# Altium schematic sheet drvoutput1.SchDoc
size A4
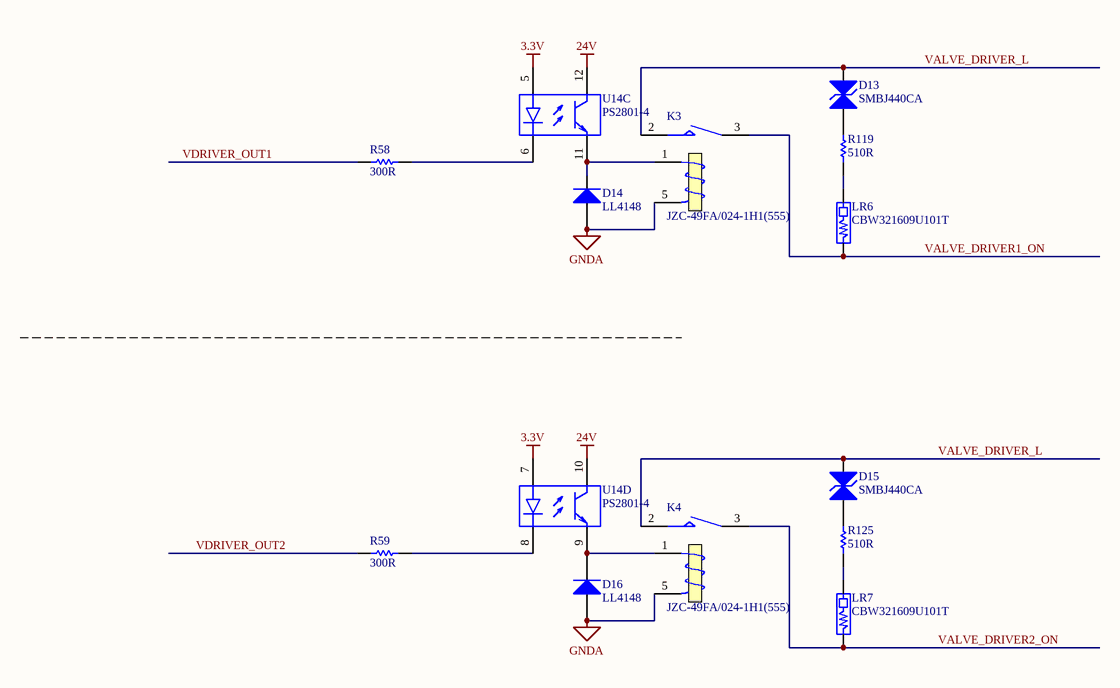
[diagram p0: drvoutput1.SchDoc]

## Parts
D13  SMBJ440CA  [SMB]
D14  LL4148  [CD2012-0805]
D15  SMBJ440CA  [SMB]
D16  LL4148  [CD2012-0805]
K3  JZC-49FA/024-1H1(555)  [JZC-49FA]
K4  JZC-49FA/024-1H1(555)  [JZC-49FA]
LR6  CBW321609U101T  [INDC3216M]
LR7  CBW321609U101T  [INDC3216M]
R58  300R  [RESC2012M]
R59  300R  [RESC2012M]
R119  510R  [RESC3216M]
R125  510R  [RESC3216M]
U14  PS2801-4  [SOIC16_N]  (parts C,D of 4)

## Nets
3.3V: U14.5(+) U14.7(+)
24V: U14.10(C) U14.12(C)
GNDA: D14.1(A) D16.1(A) K3.5(T2) K4.5(T2)
VALVE_DRIVER1_ON: K3.3(NO) LR6.1
VALVE_DRIVER2_ON: K4.3(NO) LR7.1
VALVE_DRIVER_L: D13.2(K) D15.2(K) K3.2(COM) K4.2(COM)
VDRIVER_OUT1: R58.1
VDRIVER_OUT2: R59.1
NetD13_1: D13.1(A) R119.2
NetD14_2: D14.2(K) K3.1 U14.11(E)
NetD15_1: D15.1(A) R125.2
NetD16_2: D16.2(K) K4.1 U14.9(E)
NetLR6_2: LR6.2 R119.1
NetLR7_2: LR7.2 R125.1
NetR58_2: R58.2 U14.6(-)
NetR59_2: R59.2 U14.8(-)

## Library data of the parts
D13 D15 = Bi-dir TVS Diode: Published: 8-Jun-2000; LatestRevisionDate: 17-Jul-2002; LatestRevisionNote: Re-released for DXP Platform.; PackageReference: DIODE-0.7; Publisher: Altium Limited
D14 D16 = Diode 1N4007: 1 Amp General Purpose Rectifier; Published: 8-Jun-2000; LatestRevisionDate: 17-Jul-2002; LatestRevisionNote: Re-released for DXP Platform.; DatasheetVersion: 1998; PackageVersion: Aug-1999; PackageReference: DO-41; Publisher: Altium Limited; Code_JEDEC: DO-204-AL; ComponentLink1Description: Manufacturer Link; ComponentLink1URL: http://www.fairchildsemi.com/; ComponentLink2Description: Datasheet; ComponentLink2URL: http://www.fairchildsemi.com/ds/1N%2F1N4001.pdf
K3 K4 = JZC-49FA: Intermediate  Power  Relay; Published: 8-Jun-2000; LatestRevisionDate: 17-Jul-2002; LatestRevisionNote: Re-released for DXP Platform.; PackageReference: MODULE5B; Publisher: Altium Limited
LR6 LR7 = BLM10/11/21/31/41: EMI FILTERS,DC Resistance max.0.05~1.5 ohms,10 ~ 1000 ohms at 100MHz  Frequency
R58 R59 = Res1: Resistor; Value: 10K; Published: 8-Jun-2000; LatestRevisionDate: 17-Jul-2002; LatestRevisionNote: Re-released for DXP Platform.; PackageReference: AXIAL-0.3; Publisher: Altium Limited
R119 R125 = Res1: Metal film Resistor; Value: 10K; Published: 8-Jun-2000; LatestRevisionDate: 17-Jul-2002; LatestRevisionNote: Re-released for DXP Platform.; PackageReference: AXIAL-0.3; Publisher: Altium Limited
U14 = PS2801-4: The PS2801-1 and PS2801-4 are optically coupled isolators containing a GaAs light emitting diode and an NPN  silicon phototransistor in a plastic SOP for high density applications.; Published: 28-Feb-2003; LatestRevisionDate: 13-Apr-2006; LatestRevisionNote: IPC-7351 Footprint Added.; DatasheetVersion: Jan-2002, Rev. 7; PackageVersion: rev7, Jan-2002; PackageReference: 751-07; Publisher: Altium Limited; PackageDescription: 8-Pin Plastic Small Outline Integrated Circuit 1.27 mm Pitch; Code_JEDEC: MS-012-AA; Code_IPC: SOIC127P600-8; ComponentLink1Description: Manufacturer Link; ComponentLink1URL: http://www.onsemi.com/; ComponentLink2Description: Datasheet; ComponentLink2URL: http://www.onsemi.com/pub/Collateral/LM358-D.PDF